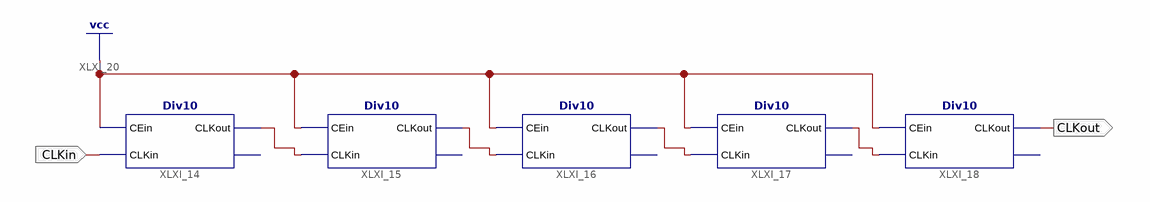
[diagram p0: schematic sheet 1]
// Xilinx ISE schematic Div100KV2.sch (spartan6) as structural Verilog: 5 symbols, 2 ports
module Div100KV2 (
  input  CLKin,
  output CLKout
);

  wire XLXN_13, XLXN_14, XLXN_15, XLXN_16;

  Div10 XLXI_14 (.CEin(1'b1), .CLKin(CLKin), .CLKout(XLXN_13));  // open: CEout
  Div10 XLXI_15 (.CEin(1'b1), .CLKin(XLXN_13), .CLKout(XLXN_14));  // open: CEout
  Div10 XLXI_16 (.CEin(1'b1), .CLKin(XLXN_14), .CLKout(XLXN_15));  // open: CEout
  Div10 XLXI_17 (.CEin(1'b1), .CLKin(XLXN_15), .CLKout(XLXN_16));  // open: CEout
  Div10 XLXI_18 (.CEin(1'b1), .CLKin(XLXN_16), .CLKout(CLKout));  // open: CEout
endmodule
